# EAGLE design stm32hw02 (EAGLE 6.6.0)
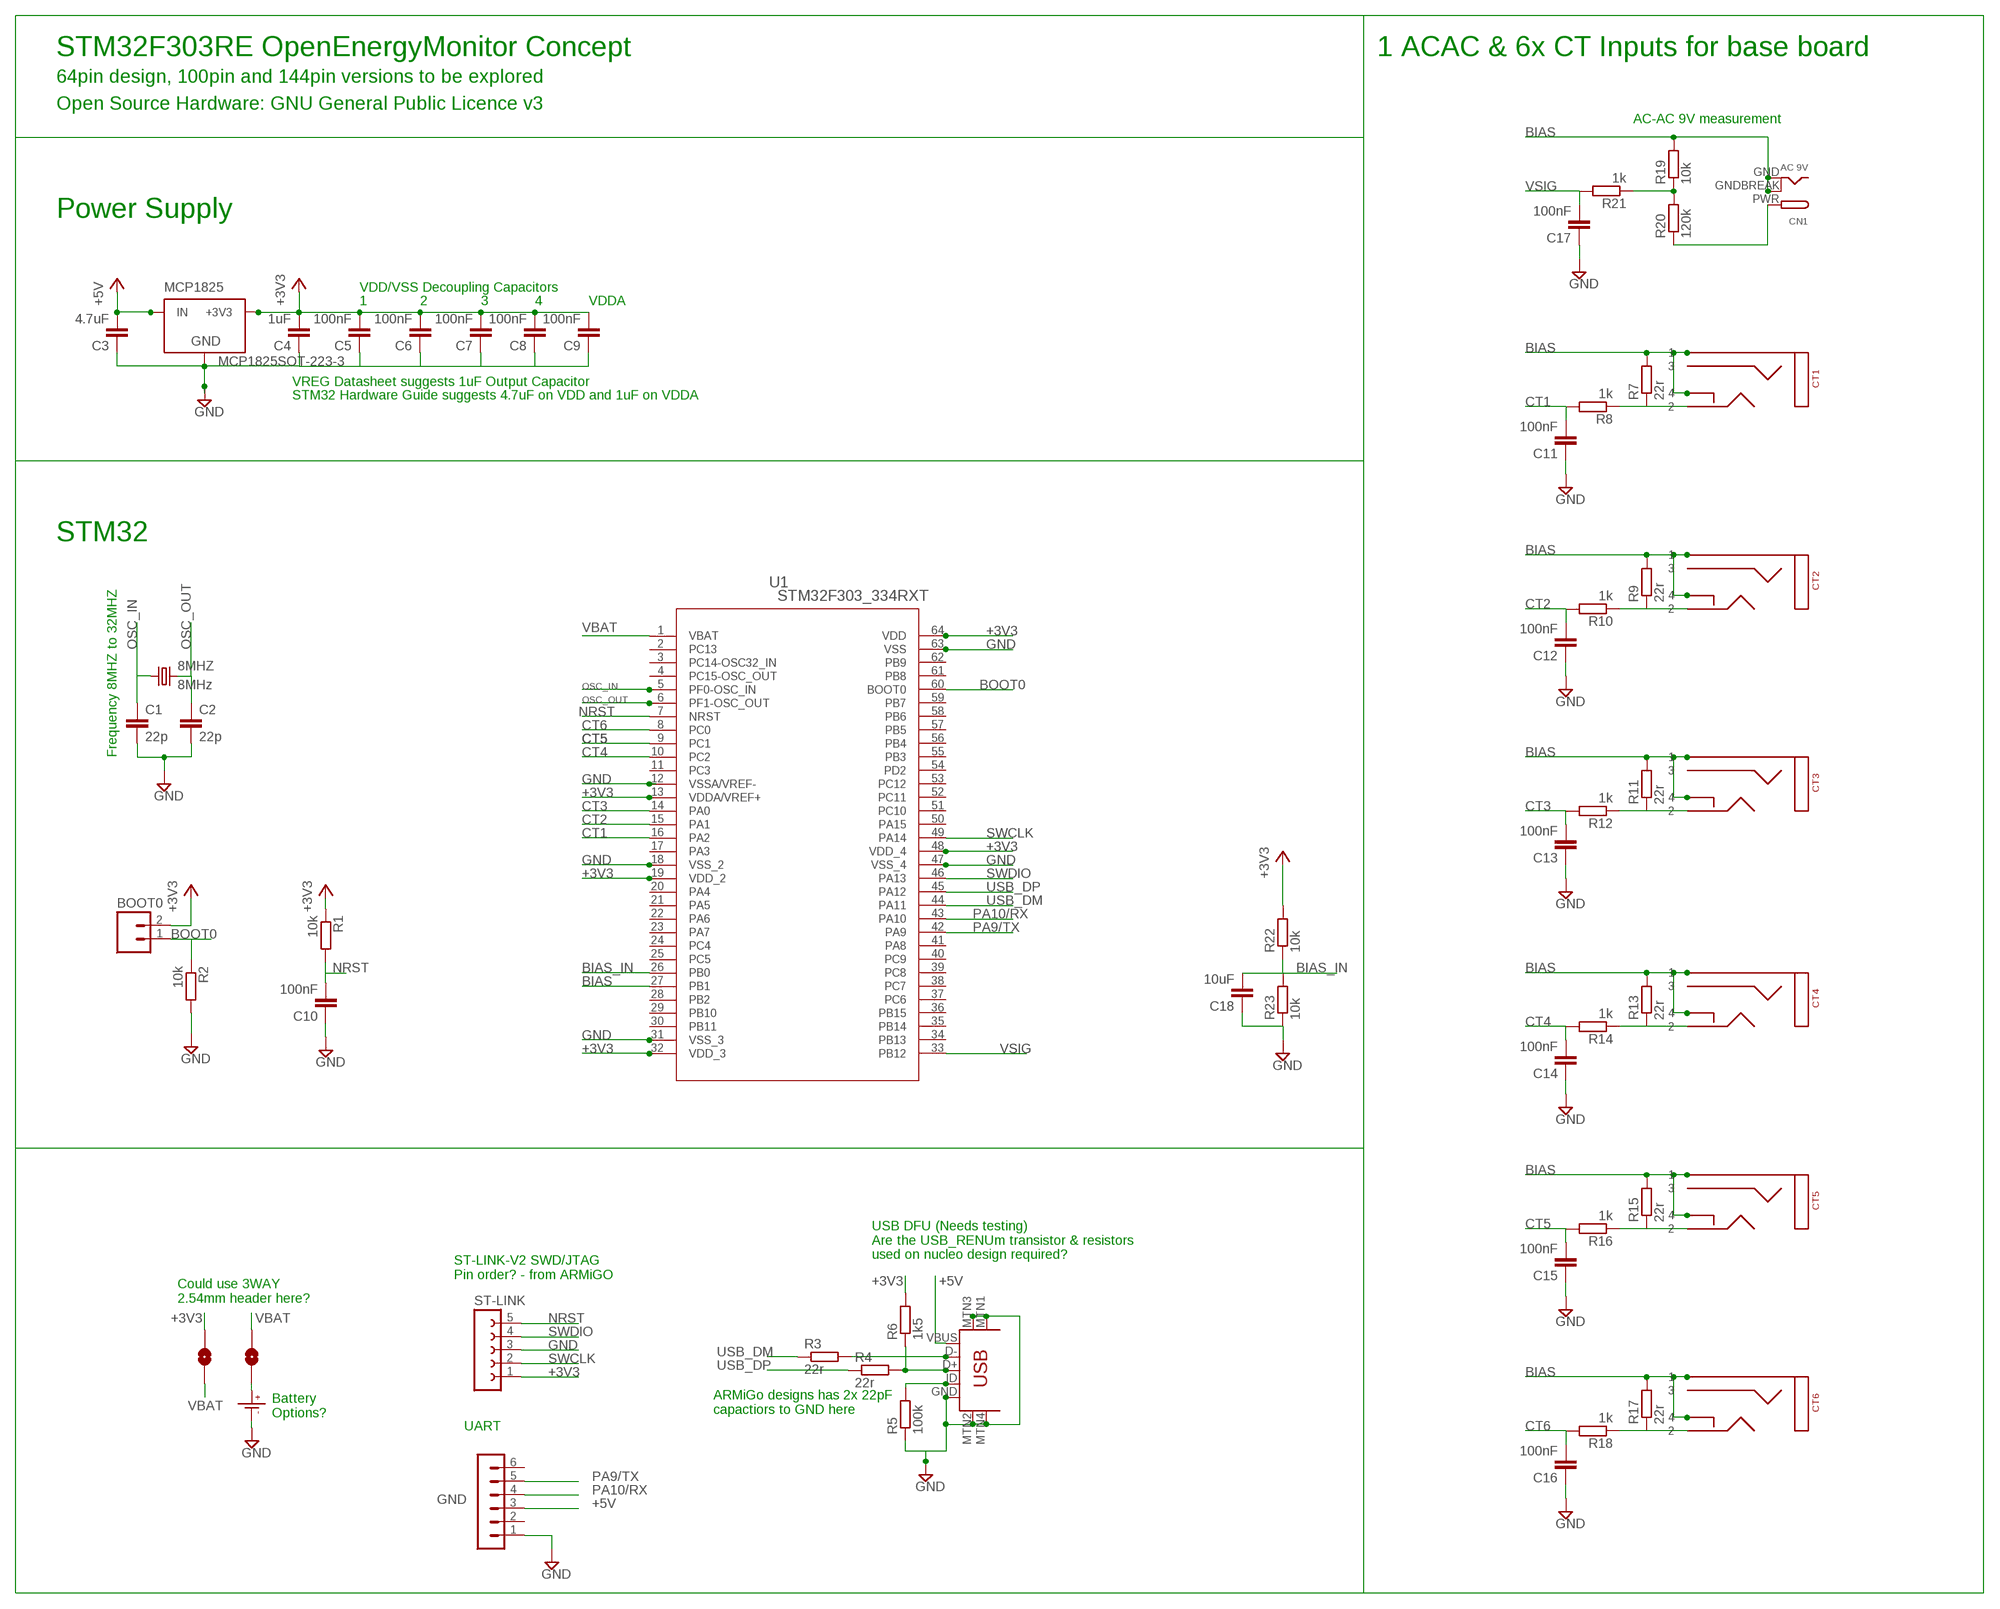
[diagram p0: schematic, sheet 1]

## Parts
3V3  SOLDERJUMPERNO  [SJ_2S-NO]
8MHZ  8MHz  CRYSTAL5X3  [CRYSTAL-SMD-5X3]
BATTERY  SOLDERJUMPERNO  [SJ_2S-NO]
BOOT0  M02PTH  [1X02]
C1  22p  C-EUC0603  [C0603]
C2  22p  C-EUC0603  [C0603]
C3  4.7uF  C-EUC0603  [C0603]
C4  1uF  C-EUC0603  [C0603]
C5  100nF  C-EUC0603  [C0603]
C6  100nF  C-EUC0603  [C0603]
C7  100nF  C-EUC0603  [C0603]
C8  100nF  C-EUC0603  [C0603]
C9  100nF  C-EUC0603  [C0603]
C10  100nF  C-EUC0603  [C0603]
C11  100nF  C-EUC0603  [C0603]
C12  100nF  C-EUC0603  [C0603]
C13  100nF  C-EUC0603  [C0603]
C14  100nF  C-EUC0603  [C0603]
C15  100nF  C-EUC0603  [C0603]
C16  100nF  C-EUC0603  [C0603]
C17  100nF  C-EUC0603  [C0603]
C18  10uF  C-EUC0603  [C0603]
CN1  AC 9V  DCBARRELPTH  [DCJACK_2MM_PTH]
CR1220  CR1220SMD  [CR1220SMD]
CT1  STEREO_SMD  [STEREO_SMT]
CT2  STEREO_SMD  [STEREO_SMT]
CT3  STEREO_SMD  [STEREO_SMT]
CT4  STEREO_SMD  [STEREO_SMT]
CT5  STEREO_SMD  [STEREO_SMT]
CT6  STEREO_SMD  [STEREO_SMT]
GND  UART  MA06-1  [MA06-1]
MCP1825  MCP1825SOT-223-3  [SOT-223]
R1  10k  R-EU_R0603  [R0603]
R2  10k  R-EU_R0603  [R0603]
R3  22r  R-EU_R0603  [R0603]
R4  22r  R-EU_R0603  [R0603]
R5  100k  R-EU_R0603  [R0603]
R6  1k5  R-EU_R0603  [R0603]
R7  22r  R-EU_R0603  [R0603]
R8  1k  R-EU_R0603  [R0603]
R9  22r  R-EU_R0603  [R0603]
R10  1k  R-EU_R0603  [R0603]
R11  22r  R-EU_R0603  [R0603]
R12  1k  R-EU_R0603  [R0603]
R13  22r  R-EU_R0603  [R0603]
R14  1k  R-EU_R0603  [R0603]
R15  22r  R-EU_R0603  [R0603]
R16  1k  R-EU_R0603  [R0603]
R17  22r  R-EU_R0603  [R0603]
R18  1k  R-EU_R0603  [R0603]
R19  10k  R-EU_R0603  [R0603]
R20  120k  R-EU_R0603  [R0603]
R21  1k  R-EU_R0603  [R0603]
R22  10k  R-EU_R0603  [R0603]
R23  10k  R-EU_R0603  [R0603]
ST-LINK  FE05-1  [FE05-1]
U1  STM32F303_334RXT  [LQFP64-10X10MM]
U$10  USB-MINIB-5PIN  [USB-MINIB-CISECO]

## Nets
+3V3: 3V3.1 BOOT0.2 C4.2 C5.2 C6.2 C7.2 C8.2 C9.2 MCP1825.3(+3V3) R1.1 R6.2 R22.2 ST-LINK.1 U1.13(VDDA/VREF+) U1.19(VDD_2) U1.32(VDD_3) U1.48(VDD_4) U1.64(VDD)
+5V: C3.2 GND.3 MCP1825.1(IN) U$10.VBUS
AC: CN1.PWR R20.1
ADC0: R19.1 R20.2 R21.1
BIAS: CN1.GND CN1.GNDBREAK CT1.P$1 CT1.P$4 CT2.P$1 CT2.P$4 CT3.P$1 CT3.P$4 CT4.P$1 CT4.P$4 CT5.P$1 CT5.P$4 CT6.P$1 CT6.P$4 R7.2 R9.2 R11.2 R13.2 R15.2 R17.2 R19.2 U1.27(PB1)
BIAS_IN: C18.2 R22.1 R23.2 U1.26(PB0)
BOOT0: BOOT0.1 R2.1 U1.60(BOOT0)
CT1: C11.2 R8.2 U1.16(PA2)
CT2: C12.2 R10.2 U1.15(PA1)
CT3: C13.2 R12.2 U1.14(PA0)
CT4: C14.2 R14.2 U1.10(PC2)
CT5: C15.2 R16.2 U1.9(PC1)
CT6: C16.2 R18.2 U1.8(PC0)
GND: C1.2 C2.2 C3.1 C4.1 C5.1 C6.1 C7.1 C8.1 C9.1 C10.1 C11.1 C12.1 C13.1 C14.1 C15.1 C16.1 C17.1 C18.1 CR1220.P-(P$-) GND.1 MCP1825.2(GND) R2.2 R5.1 R23.1 ST-LINK.3 U1.12(VSSA/VREF-) U1.18(VSS_2) U1.31(VSS_3) U1.47(VSS_4) U1.63(VSS) U$10.GND U$10.MTN1(MTN2) U$10.MTN2(MTN3) U$10.MTN3(MTN1) U$10.MTN4
N$1: BATTERY.2 CR1220.P+(P$+)
N$2: CT1.P$2 R7.1 R8.1
N$3: R5.2 U$10.ID
N$6: R4.2 R6.1 U$10.D+
N$7: R3.2 U$10.D-
N$8: CT2.P$2 R9.1 R10.1
N$10: CT3.P$2 R11.1 R12.1
N$12: CT4.P$2 R13.1 R14.1
N$14: CT5.P$2 R15.1 R16.1
N$16: CT6.P$2 R17.1 R18.1
NRST: C10.2 R1.2 ST-LINK.5 U1.7(NRST)
OSC_IN: 8MHZ.1 C1.1 U1.5(PF0-OSC_IN)
OSC_OUT: 8MHZ.3 C2.1 U1.6(PF1-OSC_OUT)
PA9/TX: GND.5 U1.42(PA9)
PA10/RX: GND.4 U1.43(PA10)
SWCLK: ST-LINK.2 U1.49(PA14)
SWDIO: ST-LINK.4 U1.46(PA13)
USB_DM: R3.1 U1.44(PA11)
USB_DP: R4.1 U1.45(PA12)
VBAT: 3V3.2 BATTERY.1 U1.1(VBAT)
VSIG: C17.2 R21.2 U1.33(PB12)
Unconnected: CT1.P$3 CT2.P$3 CT3.P$3 CT4.P$3 CT5.P$3 CT6.P$3 GND.2 GND.6 U1.2(PC13) U1.3(PC14-OSC32_IN) U1.4(PC15-OSC_OUT) U1.11(PC3) U1.17(PA3) U1.20(PA4) U1.21(PA5) U1.22(PA6) U1.23(PA7) U1.24(PC4) U1.25(PC5) U1.28(PB2) U1.29(PB10) U1.30(PB11) U1.34(PB13) U1.35(PB14) U1.36(PB15) U1.37(PC6) U1.38(PC7) U1.39(PC8) U1.40(PC9) U1.41(PA8) U1.50(PA15) U1.51(PC10) U1.52(PC11) U1.53(PC12) U1.54(PD2) U1.55(PB3) U1.56(PB4) U1.57(PB5) U1.58(PB6) U1.59(PB7) U1.61(PB8) U1.62(PB9)

## Notes on the sheet
- STM32F303RE OpenEnergyMonitor Concept | 1 ACAC & 6x CT Inputs for base board
- 64pin design, 100pin and 144pin versions to be explored
- Open Source Hardware: GNU General Public Licence v3
- AC-AC 9V measurement
- Power Supply
- VDD/VSS Decoupling Capacitors
- 1 | 2 | 3 | 4 | VDDA
- VREG Datasheet suggests 1uF Output Capacitor
- STM32 Hardware Guide suggests 4.7uF on VDD and 1uF on VDDA
- STM32
- Frequency 8MHZ to 32MHZ
- USB DFU (Needs testing)
  Are the USB_RENUm transistor & resistors 
  used on nucleo design required?
- ST-LINK-V2 SWD/JTAG
  Pin order? - from ARMiGO
- Could use 3WAY
  2.54mm header here?
- ARMiGo designs has 2x 22pF
  capactiors to GND here
- Battery
  Options?
- UART

## Library data of the parts
3V3 BATTERY = SparkFun:SOLDERJUMPER: Solder Jumper Standard SMD solder jumper. Used to automate production. Two varients : Normally Open and Normally Closed are the same, but have different paste layers. NC will have a large amount of paste and should jumper during reflow.
8MHZ = SparkFun:CRYSTAL: Crystals Various standard crystals. Proven footprints. Spark Fun Electronics SKU : COM-00534
BOOT0 = SparkFun:M02: Header 2 Standard 2-pin 0.1" header. Use with straight break away headers (SKU : PRT-00116), right angle break away headers (PRT-00553), swiss pins (PRT-00743), machine pins (PRT-00117), and female headers (PRT-00115). Molex polarized connector foot print use with SKU : PRT-08233 with associated crimp pins and housings.
C1-C18 = resistor:C-EU: CAPACITOR, European symbol
CN1 = adafruit:DCBARREL: 2.0mm DC Barrel Jack DCJACK_2MM_PTH - Through Hole Jack (4UConnector: 05537)
CR1220 = IotaWatt_parts:CR1220SMD: CR1220 Battery SMD; MPN: Harwin S8411-45R
CT1-CT6 = IotaWatt_parts:STEREO_SMD: 3.5mm Stereo Jack SMT
GND = JeeLabs:MA06-1: PIN HEADER
MCP1825 = SteelCaveRobotics-Power:MCP1825: MCP1825 3.3v LDO Linear Regulator
R1-R23 = resistor:R-EU_: RESISTOR, European symbol
ST-LINK = con-lsta:FE05-1: FEMALE HEADER; OC_FARNELL: unknown; OC_NEWARK: unknown
U1 = stm32f303:STM32F303_334RXT; MANUFACTURER_PART_NUMBER: stm32f303_334rxt; VENDOR: STMicroelectronics
U$10 = Ciseco USB miniB_Updated:USB-MINIB: Mini-USB "B" connector with 5th pin broken out. Created new symbol breaking out 5th "ID" pin in mini/micro USB connector spec. See: http://en.wikipedia.org/wiki/Mini_usb#Cables. Uses same footprint as 4-pin symbol. Also added pins to connect to mounting / shield pads if required (probably not generally needed as signals aren't shielded once they leave the connector). Modified by Ciseco for Rapid Part 24-0357

## Net classes
0 default: width 0.203 mm, drill 0.6 mm, clearance 0.203 mm
1 power: width 0.381 mm, drill 0.6 mm, clearance 0.254 mm
2 gnd: width 0.254 mm, drill 0.6 mm, clearance 0.254 mm

## Board
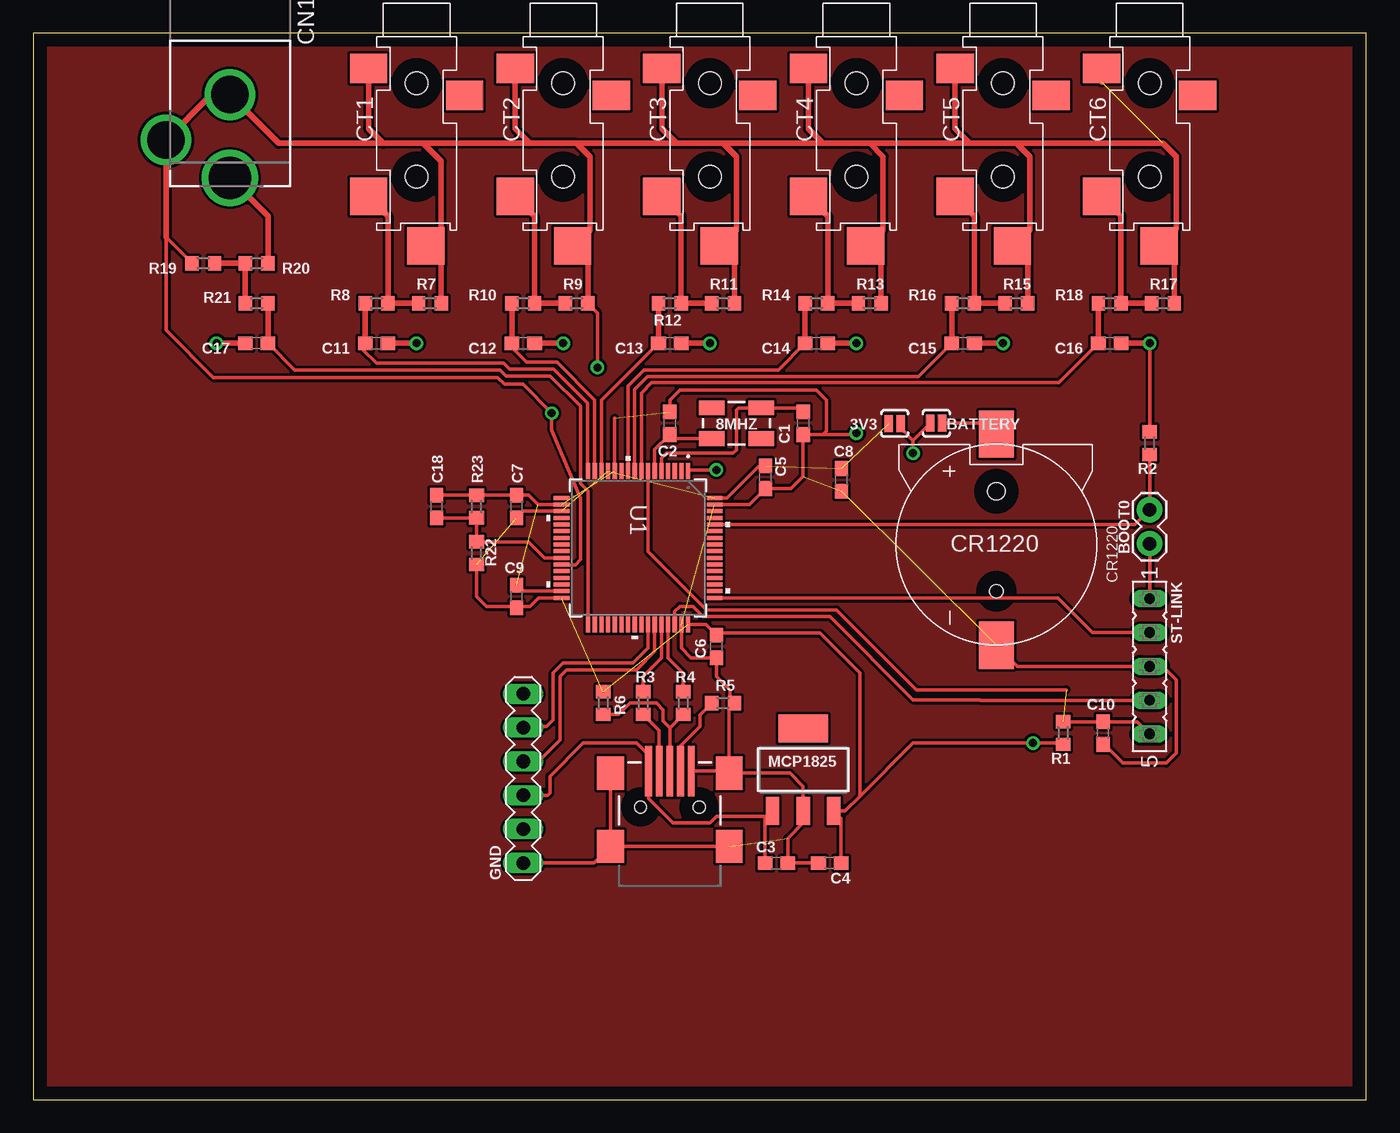
[diagram p1: board, top side]
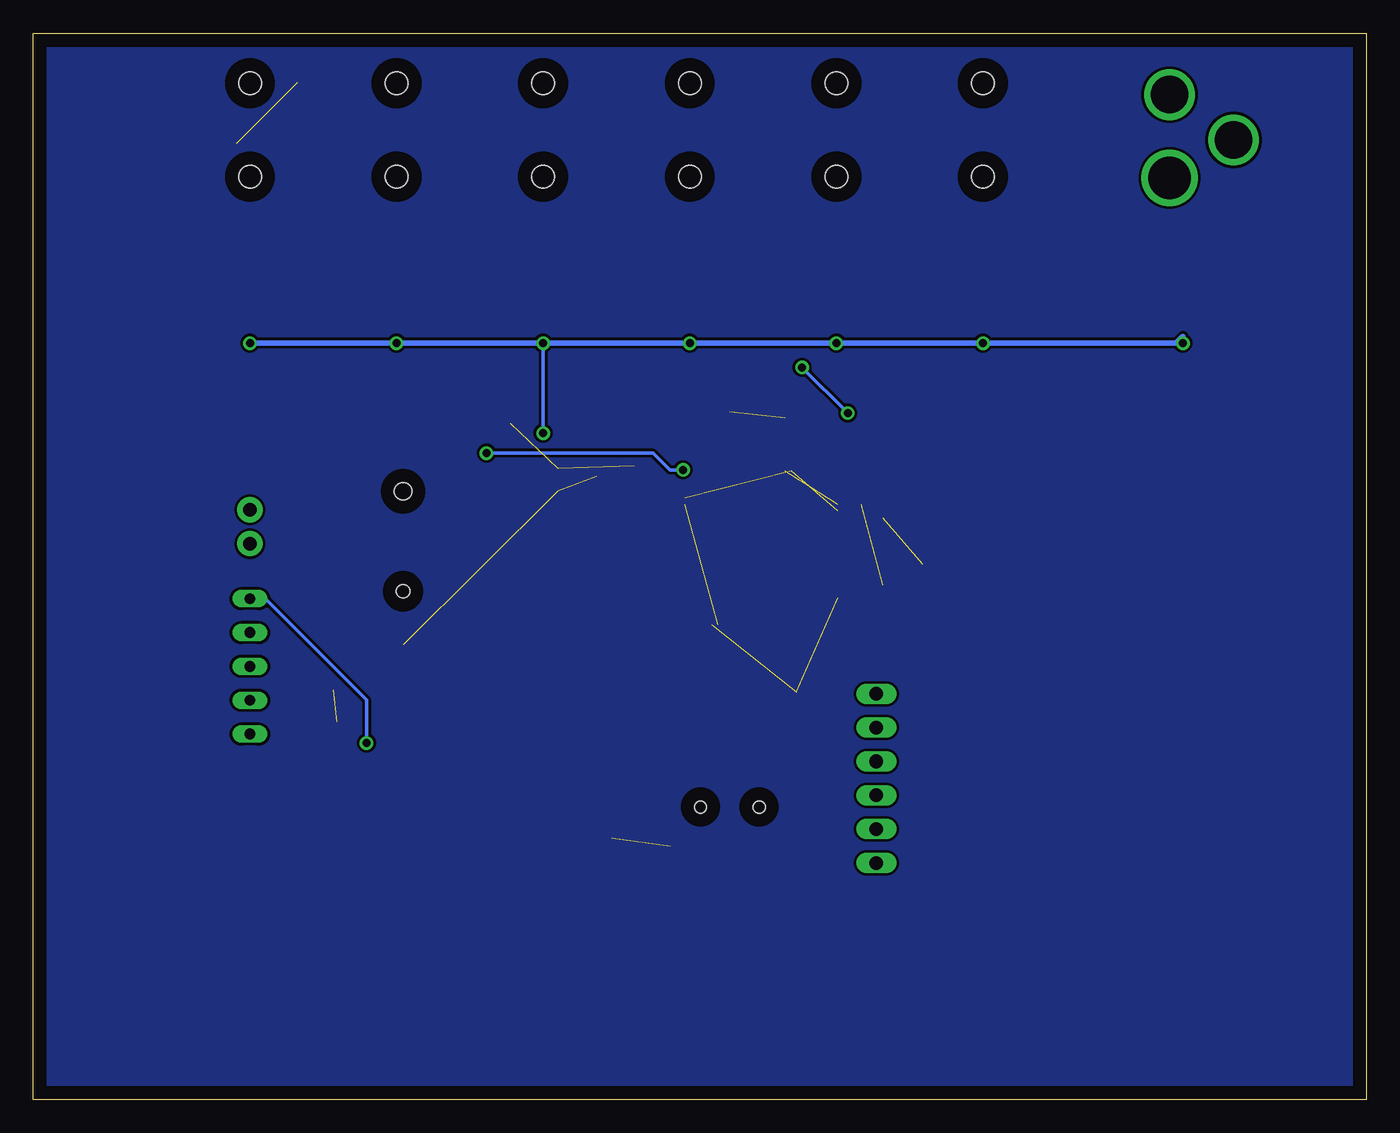
[diagram p2: board, bottom side, seen from below]

Size 100 x 80 mm. Coordinates in mm from the lower left corner, seen from the top.
Outline: 0,0 100,0 100,80 0,80 0,0
Copper layers (1*16): Top 0.035mm / dielectric 1.5mm / Bottom 0.035mm
Design rules "default": minimum track width 10mil, minimum drill 24mil, track to track 8mil, track to pad 8mil, pad to pad 8mil, via to via 8mil, smd to smd 8mil, copper to edge 40mil, drill to drill 8mil, minimum pad ring 10mil, minimum via ring 8mil, stop-mask expansion 4mil, vias tented up to drill 0mil, thermal gap 10mil

### Footprints (pad centres in the part's own frame; a part is rotated, then mirrored left to right if it is on the bottom)
SJ_2S-NO = smd 0.635 x 1.27: 1 -0.45,0; 2 0.45,0
CRYSTAL-SMD-5X3 = smd 1.9 x 1.1: 1 -1.85,-1.15; 2 1.85,-1.15; 3 1.85,1.15; 4 -1.85,1.15
1X02 = drill 1.016 pad 1.88: 1 0,0; 2 2.54,0
C0603 = smd 1.1 x 1: 1 -0.85,0; 2 0.85,0
DCJACK_2MM_PTH = drill 2.8: GND 0,7.35; GNDBREAK 4.8,10.75 | drill 3.2: PWR 0,13.6
CR1220SMD = smd 3.54 x 2.6: P+ 8.3,0; P- -7.55,0 | hole 1: -3.5,0 | hole 1.3: 4,0
STEREO_SMT = smd 2.8 x 2.2: P$1 -3.6,-2.4; P$3 3.6,-4.4 | smd 2.8 x 2.8: P$2 -3.6,-12; P$4 0.7,-15.7 | hole 1.7: 0,-3.5; 0,-10.5
MA06-1 = drill 1.016 long: 1 0,0; 2 2.54,0; 3 5.08,0; 4 7.62,0; 5 10.16,0; 6 12.7,0
SOT-223 = smd 1 x 2.1: 1 -2.3,-3.1; 2 0,-3.1; 3 2.3,-3.1 | smd 3.7 x 2.1: 4 0,3.1
R0603 = smd 1 x 1.1: 1 -0.85,0; 2 0.85,0
FE05-1 = drill 0.813 long: 1 -5.08,0; 2 -2.54,0; 3 0,0; 4 2.54,0; 5 5.08,0
LQFP64-10X10MM = smd 1.194 x 0.305: 1 -5.75,3.75; 2 -5.75,3.25; 3 -5.75,2.75; 4 -5.75,2.25; 5 -5.75,1.75; 6 -5.75,1.25; 7 -5.75,0.75; 8 -5.75,0.25; 9 -5.75,-0.25; 10 -5.75,-0.75; 11 -5.75,-1.25; 12 -5.75,-1.75; 13 -5.75,-2.25; 14 -5.75,-2.75; 15 -5.75,-3.25; 16 -5.75,-3.75; 33 5.75,-3.75; 34 5.75,-3.25; 35 5.75,-2.75; 36 5.75,-2.25; 37 5.75,-1.75; 38 5.75,-1.25; 39 5.75,-0.75; 40 5.75,-0.25; 41 5.75,0.25; 42 5.75,0.75; 43 5.75,1.25; 44 5.75,1.75; 45 5.75,2.25; 46 5.75,2.75; 47 5.75,3.25; 48 5.75,3.75 | smd 0.305 x 1.194: 17 -3.75,-5.75; 18 -3.25,-5.75; 19 -2.75,-5.75; 20 -2.25,-5.75; 21 -1.75,-5.75; 22 -1.25,-5.75; 23 -0.75,-5.75; 24 -0.25,-5.75; 25 0.25,-5.75; 26 0.75,-5.75; 27 1.25,-5.75; 28 1.75,-5.75; 29 2.25,-5.75; 30 2.75,-5.75; 31 3.25,-5.75; 32 3.75,-5.75; 49 3.75,5.75; 50 3.25,5.75; 51 2.75,5.75; 52 2.25,5.75; 53 1.75,5.75; 54 1.25,5.75; 55 0.75,5.75; 56 0.25,5.75; 57 -0.25,5.75; 58 -0.75,5.75; 59 -1.25,5.75; 60 -1.75,5.75; 61 -2.25,5.75; 62 -2.75,5.75; 63 -3.25,5.75; 64 -3.75,5.75
USB-MINIB-CISECO = smd 3.8 x 0.5: D+ 7.9,0; D- 7.9,0.8; GND 7.9,-1.6; ID 7.9,-0.8; VBUS 7.9,1.6 | smd 2.5 x 2: MTN1 2.25,4.45; MTN2 7.75,4.45; MTN3 2.25,-4.45; MTN4 7.75,-4.45 | hole 0.9: 5.2,2.2; 5.2,-2.2

### Placement (x,y rotation side)
3V3  64.64,50.73 0 top
8MHZ  52.75,50.75 180 top
BATTERY  67.75,50.75 0 top
BOOT0  83.75,44.25 270 top
C1  57.75,50.75 270 top
C2  47.75,50.75 90 top
C3  55.75,17.75 180 top
C4  59.75,17.75 0 top
C5  54.93,46.7 90 top
C6  51.25,34 90 top
C7  36.25,44.5 270 top
C8  60.63,46.49 90 top
C9  36.25,37.75 270 top
C10  80.25,27.5 90 top
C11  25.75,56.75 180 top
C12  36.75,56.75 180 top
C13  47.75,56.75 180 top
C14  58.75,56.75 180 top
C15  69.75,56.75 180 top
C16  80.75,56.75 180 top
C17  16.75,56.75 0 top
C18  30.25,44.5 270 top
CN1  14.75,82.75 180 top
CR1220  72.25,41.64 90 top
CT1  28.75,79.75 0 top
CT2  39.75,79.75 0 top
CT3  50.75,79.75 0 top
CT4  61.75,79.75 0 top
CT5  72.75,79.75 0 top
CT6  83.75,79.75 0 top
GND  36.75,17.75 90 top
MCP1825  57.75,24.75 0 top
R1  77.25,27.5 90 top
R2  83.75,49.25 90 top
R3  45.75,29.75 270 top
R4  48.75,29.75 270 top
R5  51.75,29.75 180 top
R6  42.75,29.75 90 top
R7  29.75,59.75 0 top
R8  25.75,59.75 180 top
R9  40.75,59.75 0 top
R10  36.75,59.75 180 top
R11  51.75,59.75 0 top
R12  47.75,59.75 180 top
R13  62.75,59.75 0 top
R14  58.75,59.75 180 top
R15  73.75,59.75 0 top
R16  69.75,59.75 180 top
R17  84.75,59.75 0 top
R18  80.75,59.75 180 top
R19  12.75,62.75 180 top
R20  16.75,62.75 180 top
R21  16.75,59.75 0 top
R22  33.25,41 270 top
R23  33.25,44.5 270 top
ST-LINK  83.75,32.5 270 top
U1  45.37,41.39 270 top
U$10  47.75,16.75 90 top

### Tracks (layer width: path | path; a pad name or v marks a point on that pad's centre or on a via)
+3V3  (via drill 0.6)  (7 unrouted)
  Top 0.254: C5.2 54.87,47.49 54.39,47.49 52.05,45.14 U1.64 | U1.19 36.74,44.14 C7.2 36.25,43.75 | U1.32 37.89,37.64 37.25,37 36.35,37 C9.2 36.15,37 34,37 33.25,37.75 R22.2 | BOOT0.2 ST-LINK.1 | U1.48 50.46,35.64 C6.2 51.4,35 59,35 62,32 62,22.75 | C4.2 60.6,21.1 MCP1825.3 60.9,21.65 62,22.75 | R1.1 77.25,26.75 v75,26.75 66,26.75 62,22.75
  Bottom 0.254: ST-LINK.1 83.67,37.5 82.5,37.5 75,30 v75,26.75
+5V
  Top 0.254: C3.2 54.9,21.1 MCP1825.1 55.05,21.25 51.25,21.25 50.75,20.75 48,20.75 46.15,22.6 U$10.VBUS 46.15,25.85 45.25,26.75 41.25,26.75 38.75,24.25 38.75,23 38.58,22.83 GND.3
AC
  Top 0.406: CN1.PWR 17.6,66.3 R20.1
ADC0
  Top 0.406: R19.1 R20.2 R21.1
BIAS  (via drill 0.6)  (1 unrouted)
  Top 0.254: R9.2 42.33,59.02 v42.33,54.93 | U1.27 39.64,40.12 40.67,40.12 41.06,40.5 41.06,45.08 38.9,50.23 v38.9,51.51 36.74,53.66 35.34,53.66 34.83,54.17 13.5,54.17 9.95,57.72 9.95,64.7 R19.2
  Top 0.406: 9.95,64.7 CN1.GNDBREAK 13.35,75.4 CN1.GND 18.4,71.75 26.25,71.75 | 26.05,78.25 CT1.P$1 25.15,72.85 26.25,71.75 | 35.25,78.25 CT2.P$1 | CT2.P$1 37.05,78.25 | CT1.P$4 30.6,62.9 | 30.6,62.9 R7.2 | CT2.P$4 41.6,62.9 | 41.6,62.9 R9.2 | R11.2 52.6,62.9 CT3.P$4 51.55,64.05 52.75,65.25 52.75,70.75 51.75,71.75 | R13.2 63.6,62.9 CT4.P$4 62.55,64.05 63.75,65.25 63.75,70.75 62.75,71.75 | R15.2 74.6,62.9 CT5.P$4 73.55,64.05 74.75,65.25 74.75,70.75 73.75,71.75 | R17.2 85.6,62.9 CT6.P$4 85.75,65.35 85.75,70.75 84.75,71.75 73.75,71.75 | 30.6,62.9 30.6,70.4 29.25,71.75 | 40.75,71.75 48.25,71.75 | 48.25,71.75 51.75,71.75 | 51.75,71.75 59.25,71.75 | 59.25,71.75 62.75,71.75 | 62.75,71.75 70.25,71.75 | 70.25,71.75 73.75,71.75 | 41.6,62.9 41.6,65.1 41.75,65.25 41.75,70.75 40.75,71.75 | 40.75,71.75 37.25,71.75 | 37.25,71.75 29.25,71.75 | 29.25,71.75 26.25,71.75 | 80.15,76.35 CT6.P$1 | CT2.P$1 36.15,72.85 37.25,71.75 | CT3.P$1 47.15,72.85 48.25,71.75 | CT4.P$1 58.15,72.85 59.25,71.75 | CT5.P$1 69.15,72.85 70.25,71.75
  Bottom 0.254: v42.33,54.93 v38.9,51.51
BIAS_IN
  Top 0.254: C18.2 R23.2 R22.1 37.15,41.85 38.36,40.64 U1.26
BOOT0
  Top 0.254: R2.1 BOOT0.1 82.64,43.14 U1.60
CT1
  Top 0.254: C11.2 24.75,56.6 24.75,56.25 25.75,55.25 35.28,55.25 35.72,54.81 39.02,54.81 41.59,52.24 41.59,47.11 U1.16
  Top 0.406: R8.2 C11.2
CT2
  Top 0.254: C12.2 35.75,56.6 35.75,56.56 36.99,55.31 39.28,55.31 42.12,52.47 U1.15
  Top 0.406: R10.2 C12.2
CT3
  Top 0.254: C13.2 42.62,52.47 U1.14
  Top 0.406: R12.2 C13.2
CT4
  Top 0.254: C14.2 55.9,54.75 45.83,54.75 44.61,53.54 44.61,47.16 U1.10
  Top 0.406: R14.2 C14.2
CT5
  Top 0.254: C15.2 66.4,54.25 46.09,54.25 45.12,53.28 U1.9
  Top 0.406: R16.2 C15.2
CT6
  Top 0.254: C16.2 76.94,53.79 46.39,53.79 45.62,53.02 U1.8
  Top 0.406: R18.2 C16.2
GND  (via drill 0.6)  (7 unrouted)
  Top 0.254: U1.63 53.73,44.64 C5.1 56.84,45.84 57.75,46.75 C1.2 59.25,49.9 | U1.12 43.62,51.12 | 59.25,49.9 61.65,49.9 v61.75,50 | C2.2 47.75,52.5 48.5,53.25 58.75,53.25 59.5,52.5 59.5,50.15 59.25,49.9 | C18.1 R23.1 C7.1 37.15,45.35 37.86,44.64 U1.18 | U1.31 36.71,38.14 C9.1 | v83.75,56.75 R2.2 | CR1220.P- 73.85,32.5 ST-LINK.3 84.75,32.5 85.75,31.5 85.75,26 85,25.25 81.75,25.25 80.35,26.65 C10.1 | U1.47 48.62,33.88 49.35,33.15 C6.1 51.25,31.75 52.25,30.75 52.25,30.1 R5.1 52.2,29.35 U$10.MTN4 | C4.1 C3.1 56.6,19.6 57.75,20.75 MCP1825.2 57.75,23.5 56.75,24.5 U$10.MTN4 | U$10.MTN4 52.05,24.65 U$10.GND | U$10.MTN3 U$10.MTN1 | U$10.MTN1 U$10.MTN2 | GND.1 42.05,17.75 U$10.MTN1
  Top 0.406: C17.1 v13.75,56.75 | C11.1 v28.75,56.75 | C12.1 v39.75,56.75 | C13.1 v50.75,56.75 | C14.1 v61.75,56.75 | C15.1 v72.75,56.75 | C16.1 v83.75,56.75
  Bottom 0.254: v61.75,56.75 v61.75,50
  Bottom 0.406: v13.75,56.75 13.75,57.25 14.25,56.75 v28.75,56.75 v39.75,56.75 v50.75,56.75 v61.75,56.75 v72.75,56.75 v83.75,56.75
N$1
  Top 0.254: BATTERY.2 71.45,50.75 CR1220.P+
N$2
  Top 0.406: R7.1 R8.1 26.6,66.3 CT1.P$2
N$3
  Top 0.254: R5.2 50,28.85 50,28 48.55,26.55 U$10.ID
N$4
  pour Top: 0,80 0,0 100,0 100,80
N$5
  pour Bottom: 0.5,80 0.75,0 100,0 100,80
N$6
  Top 0.254: R4.2 47.75,27.9 | 47.75,27.9 U$10.D+ | 47.75,27.9 47.25,28.4 47.25,29.25 46.75,29.75 44.75,29.75 43.9,28.9 R6.1
N$7
  Top 0.254: R3.2 46.95,27.7 U$10.D-
N$8
  Top 0.406: R9.1 R10.1 37.6,66.3 CT2.P$2
N$10
  Top 0.406: R11.1 R12.1 48.6,66.3 CT3.P$2
N$12
  Top 0.406: R13.1 R14.1 59.6,66.3 CT4.P$2
N$14
  Top 0.406: R15.1 R16.1 70.6,66.3 CT5.P$2
N$16
  Top 0.406: R17.1 R18.1 81.6,66.3 CT6.P$2
NRST  (1 unrouted)
  Top 0.254: ST-LINK.5 82.82,28.35 C10.2 R1.2 | U1.7 46.12,41.13 50.5,36.75 60.25,36.75 66.25,30.75 77.5,30.75
OSC_IN
  Top 0.254: U1.5 47.12,48.12 47.5,48.5 52.5,48.5 52.75,48.75 52.75,51.75 52.9,51.9 8MHZ.1 57.45,51.9 C1.1
OSC_OUT
  Top 0.254: 8MHZ.3 48.05,49.6 C2.1 46.62,48.77 U1.6
PA9/TX
  Top 0.254: GND.5 36.84,28 38.5,28 39,28.5 39,32 39.75,32.75 45,32.75 46.12,33.87 U1.42
PA10/RX
  Top 0.254: GND.4 36.88,25.5 38,25.5 39.5,27 39.5,31.75 40,32.25 45.25,32.25 46.62,33.62 U1.43
SWCLK
  Top 0.254: U1.49 76.86,37.64 79.46,35.04 ST-LINK.2
SWDIO
  Top 0.254: U1.46 48.12,36.62 48.5,37 49.5,37 50.25,36.25 59.75,36.25 66,30 71,30 71.04,29.96 ST-LINK.4
USB_DM
  Top 0.254: R3.1 45.75,31.75 47.12,33.12 U1.44
USB_DP
  Top 0.254: R4.1 48.75,32 47.62,33.13 U1.45
VBAT  (via drill 0.6)
  Top 0.254: U1.1 49.23,47.25 v51.25,47.25 | BATTERY.1 66,49.45 | 66,49.45 v66,48.5 | 3V3.2 65.08,50.37 66,49.45
  Bottom 0.254: v51.25,47.25 52.25,47.25 53.5,48.5 v66,48.5
VSIG
  Top 0.254: C17.2 19.6,54.75 35.02,54.75 35.47,54.3 38.77,54.3 41.06,52.01 41.06,46.22 41.62,45.65 U1.33
  Top 0.406: R21.2 C17.2